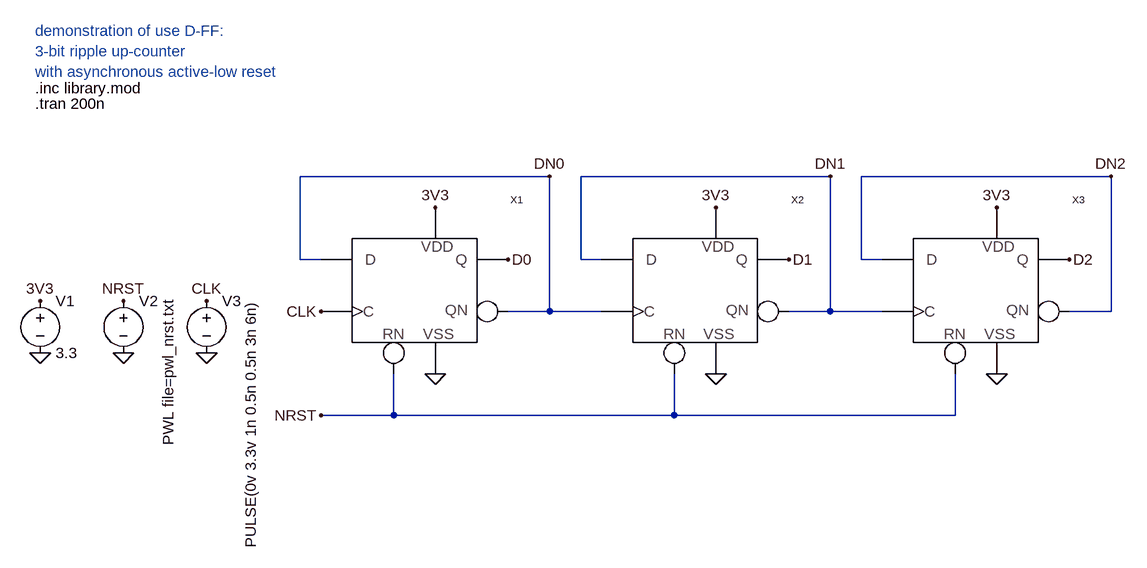
[diagram p0: schematic example_DFRRLHDX1.asc]
example_DFRRLHDX1.asc, the LTspice schematic file:
Version 4
SHEET 1 880 1080
WIRE -96 -32 -480 -32
WIRE 336 -32 -48 -32
WIRE 768 -32 384 -32
WIRE -480 96 -480 -32
WIRE -448 96 -480 96
WIRE -48 96 -48 -32
WIRE -16 96 -48 96
WIRE 384 96 384 -32
WIRE 416 96 384 96
WIRE -96 176 -96 -32
WIRE -96 176 -160 176
WIRE -16 176 -96 176
WIRE 336 176 336 -32
WIRE 336 176 272 176
WIRE 416 176 336 176
WIRE 768 176 768 -32
WIRE 768 176 704 176
WIRE -336 336 -336 272
WIRE -336 336 -448 336
WIRE 96 336 96 272
WIRE 96 336 -336 336
WIRE 528 336 528 272
WIRE 528 336 96 336
FLAG -448 176 CLK
FLAG -96 -32 DN0
FLAG 336 -32 DN1
FLAG 768 -32 DN2
FLAG -272 16 3V3
FLAG 160 16 3V3
FLAG 592 16 3V3
FLAG -272 272 0
FLAG 160 272 0
FLAG 592 272 0
FLAG -448 336 NRST
FLAG -880 240 0
FLAG -752 240 0
FLAG -624 240 0
FLAG -880 160 3V3
FLAG -752 160 NRST
FLAG -624 160 CLK
FLAG -160 96 D0
FLAG 272 96 D1
FLAG 704 96 D2
SYMBOL voltage -880 144 R0
WINDOW 123 0 0 Left 0
WINDOW 39 0 0 Left 0
SYMATTR InstName V1
SYMATTR Value 3.3
SYMBOL voltage -752 144 R0
WINDOW 3 69 13 VRight 2
WINDOW 123 0 0 Left 0
WINDOW 39 0 0 Left 0
SYMATTR Value PWL file=pwl_nrst.txt
SYMATTR InstName V2
SYMBOL voltage -624 144 R0
WINDOW 3 68 14 VRight 2
WINDOW 123 0 0 Left 0
WINDOW 39 0 0 Left 0
SYMATTR Value PULSE(0v 3.3v 1n 0.5n 0.5n 3n 6n)
SYMATTR InstName V3
SYMBOL DFRRLHDX1 -368 112 R0
SYMATTR InstName X1
SYMBOL DFRRLHDX1 64 112 R0
SYMATTR InstName X2
SYMBOL DFRRLHDX1 496 112 R0
SYMATTR InstName X3
TEXT -888 -144 Left 2 !.tran 200n
TEXT -888 -168 Left 2 !.inc library.mod
TEXT -888 -256 Left 2 ;demonstration of use D-FF:\n3-bit ripple up-counter \nwith asynchronous active-low reset

The netlist it stands for:
* example_DFRRLHDX1.asc
V1 3V3 0 3.3
V2 NRST 0 PWL file=pwl_nrst.txt
V3 CLK 0 PULSE(0v 3.3v 1n 0.5n 0.5n 3n 6n)
XX1 DN0 CLK NRST DN0 D0 3V3 0 DFRRLHDX1  ; pins D C RN QN Q VDD VSS
XX2 DN1 DN0 NRST DN1 D1 3V3 0 DFRRLHDX1  ; pins D C RN QN Q VDD VSS
XX3 DN2 DN1 NRST DN2 D2 3V3 0 DFRRLHDX1  ; pins D C RN QN Q VDD VSS
.tran 200n
.inc library.mod
* demonstration of use D-FF:
* 3-bit ripple up-counter
* with asynchronous active-low reset
.backanno
.end

* Results of the author's LTspice run, read from the files saved beside the schematic
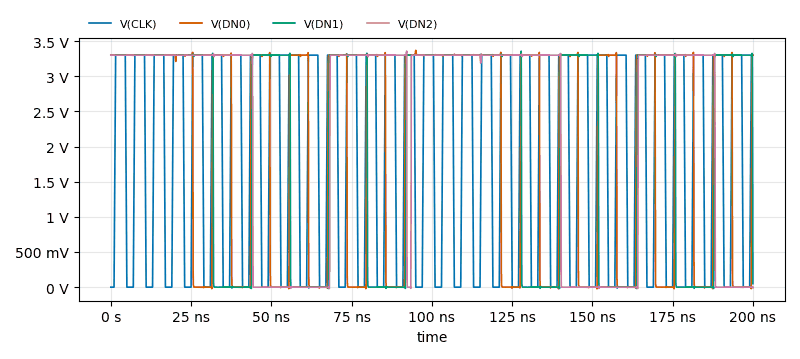
[diagram p1: Transient Analysis of example_DFRRLHDX1.asc, plotted from the saved traces]
* Transient Analysis, 1 run:
*   V(CLK): min 0 V, max 3.3 V, average 1.918 V, rms 2.458 V, last 3.3 V
*   V(DN0): min -23.51 mV, max 3.368 V, average 2.011 V, rms 2.568 V, last 3.3 V
*   V(DN1): min -19.14 mV, max 3.357 V, average 2.109 V, rms 2.634 V, last 49.84 mV
*   V(DN2): min -20.15 mV, max 3.359 V, average 2.292 V, rms 2.749 V, last -10.84 mV